# Altium schematic sheet 03.-Main Processor.SchDoc
size A4
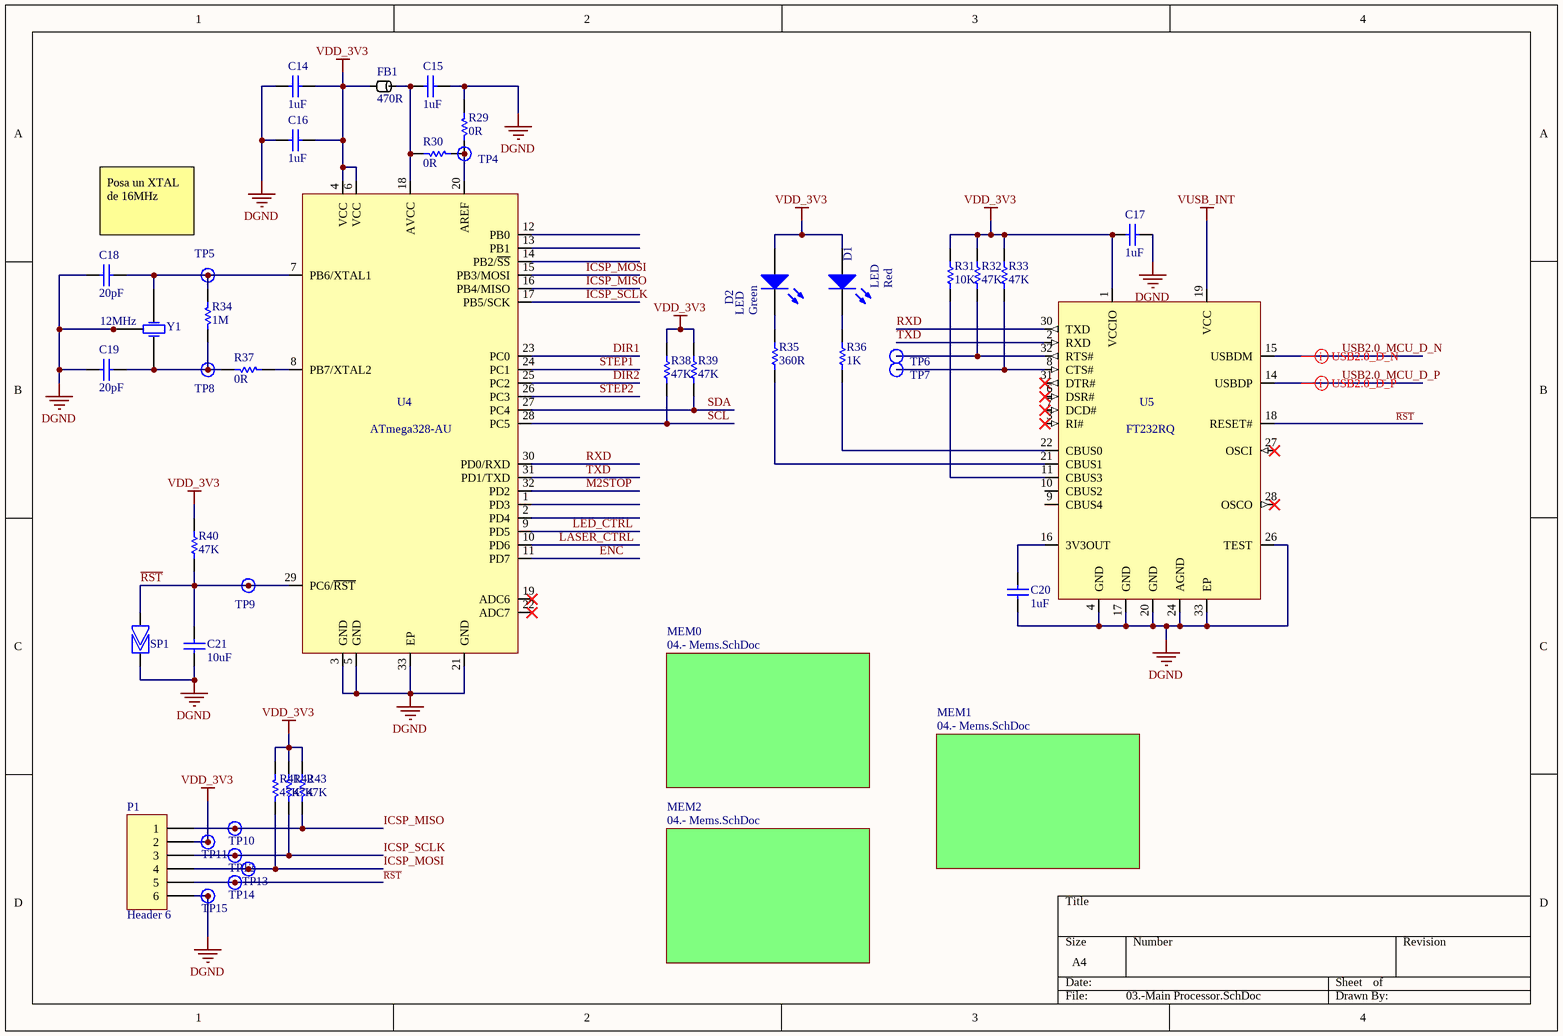
[diagram p0: 03.-Main Processor.SchDoc]

## Parts
C14  1uF  [CAPC1005N]
C15  1uF  [CAPC1005N]
C16  1uF  [CAPC1005N]
C17  1uF  [CAPC1005N]
C18  20pF  [CAPC1608N]
C19  20pF  [CAPC1608N]
C20  1uF  [CAPC1005N]
C21  10uF  [CAPC1608N]
D1  LED  color1: Red  [LED_1206]
D2  LED  color1: Green  [LED_1206]
FB1  470R  [INDC1608M]
P1  Header 6  [HDR1X6]
R29  0R  [RESC1005M]
R30  0R  [RESC1005M]
R31  10K  [RESC1608M]
R32  47K  [RESC1005M]
R33  47K  [RESC1005M]
R34  1M  [RESC1608M]
R35  360R  [RESC1608M]
R36  1K  [RESC1608M]
R37  0R  [RESC1005M]
R38  47K  [RESC1005M]
R39  47K  [RESC1005M]
R40  47K  [RESC1005M]
R41  47K  [RESC1005M]
R42  47K  [RESC1005M]
R43  47K  [RESC1005M]
SP1  SOLDERPAD_2  [SOLDERPAD_2]  (value not drawn)
TP4  TESTPOINT  [TestPoint]  (value not drawn)
TP5  TESTPOINT  [TestPoint]  (value not drawn)
TP6  TESTPOINT  [TestPoint]  (value not drawn)
TP7  TESTPOINT  [TestPoint]  (value not drawn)
TP8  TESTPOINT  [TestPoint]  (value not drawn)
TP9  TESTPOINT  [TestPoint]  (value not drawn)
TP10  TESTPOINT  [TestPoint]  (value not drawn)
TP11  TESTPOINT  [TestPoint]  (value not drawn)
TP12  TESTPOINT  [TestPoint]  (value not drawn)
TP13  TESTPOINT  [TestPoint]  (value not drawn)
TP14  TESTPOINT  [TestPoint]  (value not drawn)
TP15  TESTPOINT  [TestPoint]  (value not drawn)
U4  ATmega328-AU  [TQFP80P900X900-32L]
U5  FT232RQ  [QFN50P500X500-32VAN]
Y1  value 12MHz  [Oscillator 3,2 x 2,5 4pin]  (hidden comment: 403C35D12M00000)

## Sub-sheets
MEM0 = 04.- Mems.SchDoc: no entries
MEM1 = 04.- Mems.SchDoc: no entries
MEM2 = 04.- Mems.SchDoc: no entries

## Nets
DGND: C14.1 C15.2 C16.2 C17.2 C18.1 C19.1 C20.1 C21.1 P1.6 R29.1 SP1.1 TP15.1 U4.3(GND) U4.5(GND) U4.21(GND) U4.33(EP) U5.4(GND) U5.17(GND) U5.20(GND) U5.24(AGND) U5.26(TEST) U5.33(EP) Y1.2(IO1-1) Y1.4(IO1-1)
VDD_3V3: C14.2 C16.1 C17.1 D1.1(A) D2.1(A) FB1.2 P1.2 R31.2 R32.2 R33.2 R38.2 R39.2 R40.2 R41.2 R42.2 R43.2 TP11.1 U4.4(VCC) U4.6(VCC) U5.1(VCCIO)
VUSB_INT: U5.19(VCC)
DIR1: U4.23(PC0)
DIR2: U4.25(PC2)
ENC: U4.11(PD7)
ICSP_MISO: P1.1 R43.1 TP10.1 U4.16(PB4/MISO)
ICSP_MOSI: P1.4 R41.1 TP13.1 U4.15(PB3/MOSI)
ICSP_SCLK: P1.3 R42.1 TP12.1 U4.17(PB5/SCK)
LASER_CTRL: U4.10(PD6)
LED_CTRL: U4.9(PD5)
M2STOP: U4.32(PD2)
~{RST}: C21.2 P1.5 R40.1 SP1.2 TP9.1 TP14.1 U4.29(PC6/~{RST}) U5.18(RESET#)
RXD: U4.30(PD0/RXD) U5.30(TXD)
SCL: R38.1 U4.28(PC5)
SDA: R39.1 U4.27(PC4)
STEP1: U4.24(PC1)
STEP2: U4.26(PC3)
TXD: U4.31(PD1/TXD) U5.2(RXD)
USB2.0_MCU_D_N: U5.15(USBDM)
USB2.0_MCU_D_P: U5.14(USBDP)
NetC15_1: C15.1 FB1.1 R30.2 U4.18(AVCC)
NetC18_2: C18.2 R34.2 TP5.1 U4.7(PB6/XTAL1) Y1.1(IO1-1)
NetC19_2: C19.2 R34.1 R37.2 TP8.1 Y1.3(IO1-1)
NetC20_2: C20.2 U5.16(3V3OUT)
NetD1_2: D1.2(K) R36.2
NetD2_2: D2.2(K) R35.2
NetR29_2: R29.2 R30.1 TP4.1 U4.20(AREF)
NetR31_1: R31.1 U5.11(CBUS3)
NetR32_1: R32.1 TP6.1 U5.32(RTS#)
NetR33_1: R33.1 TP7.1 U5.8(CTS#)
NetR35_1: R35.1 U5.21(CBUS1)
NetR36_1: R36.1 U5.22(CBUS0)
NetR37_1: R37.1 U4.8(PB7/XTAL2)

Not connected (* = marked no-connect by the designer): U4 1(PD3) 2(PD4) 12(PB0) 13(PB1) 14(PB2/~{SS}) 19(ADC6)* 22(ADC7)*; U5 3(RI#)* 6(DSR#)* 7(DCD#)* 9(CBUS4) 10(CBUS2) 27(OSCI)* 28(OSCO)* 31(DTR#)*

## Layout directives
differential pair: USB2.0_MCU_D_N, USB2.0_MCU_D_P

## Notes on the sheet
- Posa un XTAL de 16MHz

## Library data of the parts
C14-C17 C20 = ISR01020111: COND. CER.1uF X5R 16V 0402; Published: 8-Jun-2000; LatestRevisionDate: 17-Jul-2002; LatestRevisionNote: Re-released for DXP Platform.; PackageReference: RAD-0.3; Publisher: Altium Limited; PackageDescription: Radial Cap, Thru-Hole; 2 Leads; 0.3 in Pin Spacing; Value: 1uF; Part Number: ISR01020111; Part Type: NON POL; Code: ISR01020111; Dielectric: X5R; Voltage: 16V; Library path: SIMBOLS_PASSIUS.SCHLIB; Footprint path: Chip_Capacitor_N.PcbLib; DatasheetDocument: http://www.avx.com/docs/Catalogs/cx7r.pdf
C18 C19 = ISR01020103: COND. SMD 20P COG 50V 0603; Published: 8-Jun-2000; LatestRevisionDate: 17-Jul-2002; LatestRevisionNote: Re-released for DXP Platform.; PackageReference: RAD-0.3; Publisher: Altium Limited; PackageDescription: Radial Cap, Thru-Hole; 2 Leads; 0.3 in Pin Spacing; Value: 20pF; Part Number: ISR01020103; Part Type: NON POL; Code: ISR01020103; Dielectric: COG; Voltage: 50V; Library path: SIMBOLS_PASSIUS.SCHLIB; Footprint path: Chip_Capacitor_N.PcbLib
C21 = ISR01020094: COND. SMD 10uF X5R 6V3 0603; Published: 8-Jun-2000; LatestRevisionDate: 17-Jul-2002; LatestRevisionNote: Re-released for DXP Platform.; PackageReference: RAD-0.3; Publisher: Altium Limited; PackageDescription: Radial Cap, Thru-Hole; 2 Leads; 0.3 in Pin Spacing; Value: 10uF; Part Number: ISR01020094; Part Type: NON POL; Code: ISR01020094; Dielectric: X5R; Voltage: 6V3; Library path: SIMBOLS_PASSIUS.SCHLIB; Footprint path: Chip_Capacitor_N.PcbLib
D1 = LXZ1-PD01: LUXEON Z Vermell 1A 3.15V; Code: ISR04060001; Value: 0; Magatzem: KS; Quantitat: 10; LatestRevisionDate: 05-oct-2007  -  Semtech; Part Number: LXZ1-PD01; Part Type: LED; Library path: SIMBOLS_SEMICONDUCTORS.SCHLIB; Footprint path: FootprintsPersonals.PcbLib
D2 = LXZ1-PM01: LUXEON Z Verd 1A 3.15V; Code: ISR04060002; Value: 0; Magatzem: KS; Quantitat: 10; LatestRevisionDate: 05-oct-2007  -  Semtech; Part Number: LXZ1-PM01; Part Type: LED; Library path: SIMBOLS_SEMICONDUCTORS.SCHLIB; Footprint path: FootprintsPersonals.PcbLib
FB1 = BLM18PG471SN1p: Ferrita SMD 470R@100MHz 25% 1A 0603; Code: ISR01040007; SRF: 100MHz; DCR: 0.2R; Impedance: *; Frequency: *; Current: *; Part Number: BLM18PG471SN1p; Part Type: FERRITES; IDC: 1A; Value: 470R; Tolerance: 25%; Library path: SIMBOLS_PASSIUS.SCHLIB; Footprint path: Chip_Inductor_M.PcbLib; DatasheetDocument: http://search.murata.co.jp/Ceramy/image/img/PDF/ENG/L0110S0100BLM18P.pdf
P1 = Header 6: Header, 6-Pin; LatestRevisionDate: 17-Jul-2002; LatestRevisionNote: Re-released for DXP Platform.; Publisher: Altium Limited
R29 R30 R37 = ISR01010776: Resistencia SMD 0402 1% 0R; Published: 8-Jun-2000; LatestRevisionDate: 17-Jul-2002; LatestRevisionNote: Re-released for DXP Platform.; PackageReference: AXIAL-0.5; Publisher: Altium Limited; PackageDescription: Axial Device, Thru-Hole; 2 Leads; 0.5 in Pin Spacing; Value: 0R; Part Number: ISR01010776; Part Type: SMD/RESISTORS; Code: ISR01010776; Tolerance: 1%; Library path: SIMBOLS_PASSIUS.SCHLIB; Footprint path: Chip_Resistor_M.PcbLib
R31 = ISR01010121: Resistencia SMD 0603 5% 10K; Published: 8-Jun-2000; LatestRevisionDate: 17-Jul-2002; LatestRevisionNote: Re-released for DXP Platform.; PackageReference: AXIAL-0.5; Publisher: Altium Limited; PackageDescription: Axial Device, Thru-Hole; 2 Leads; 0.5 in Pin Spacing; Value: 10K; Part Number: ISR01010121; Part Type: SMD/RESISTORS; Code: ISR01010121; Tolerance: 5%; Library path: SIMBOLS_PASSIUS.SCHLIB; Footprint path: Chip_Resistor_M.PcbLib
R32 R33 R38-R43 = ISR01010913: Resistencia SMD 0402 1% 47K; Published: 8-Jun-2000; LatestRevisionDate: 17-Jul-2002; LatestRevisionNote: Re-released for DXP Platform.; PackageReference: AXIAL-0.5; Publisher: Altium Limited; PackageDescription: Axial Device, Thru-Hole; 2 Leads; 0.5 in Pin Spacing; Tolerance: 1%; Value: 47K; Part Number: ISR01010913; Part Type: SMD/RESISTORS; Code: ISR01010913; Library path: SIMBOLS_PASSIUS.SCHLIB; Footprint path: Chip_Resistor_M.PcbLib
R34 = ISR01010169: Resistencia SMD 0603 5% 1M; Published: 8-Jun-2000; LatestRevisionDate: 17-Jul-2002; LatestRevisionNote: Re-released for DXP Platform.; PackageReference: AXIAL-0.5; Publisher: Altium Limited; PackageDescription: Axial Device, Thru-Hole; 2 Leads; 0.5 in Pin Spacing; Tolerance: 5%; Value: 1M; Part Number: ISR01010169; Part Type: SMD/RESISTORS; Code: ISR01010169; Library path: SIMBOLS_PASSIUS.SCHLIB; Footprint path: Chip_Resistor_M.PcbLib
R35 = ISR01010086: Resistencia SMD 0603 5% 360R; Published: 8-Jun-2000; LatestRevisionDate: 17-Jul-2002; LatestRevisionNote: Re-released for DXP Platform.; PackageReference: AXIAL-0.5; Publisher: Altium Limited; PackageDescription: Axial Device, Thru-Hole; 2 Leads; 0.5 in Pin Spacing; Value: 360R; Part Number: ISR01010086; Part Type: SMD/RESISTORS; Code: ISR01010086; Tolerance: 5%; Library path: SIMBOLS_PASSIUS.SCHLIB; Footprint path: Chip_Resistor_M.PcbLib
R36 = ISR01010097: Resistencia SMD 0603 5% 1K; Published: 8-Jun-2000; LatestRevisionDate: 17-Jul-2002; LatestRevisionNote: Re-released for DXP Platform.; PackageReference: AXIAL-0.5; Publisher: Altium Limited; PackageDescription: Axial Device, Thru-Hole; 2 Leads; 0.5 in Pin Spacing; Value: 1K; Part Number: ISR01010097; Part Type: SMD/RESISTORS; Code: ISR01010097; Tolerance: 5%; Library path: SIMBOLS_PASSIUS.SCHLIB; Footprint path: Chip_Resistor_M.PcbLib
SP1 = SOLDERPAD_2: Code: ISR04030005; Part Number: SOLDERPAD_2; Part Type: PCB; Value: SOLDERPAD_2; Library path: SIMBOLS_CONNECTORS.SCHLIB; Footprint path: FootprintsPersonals.PcbLib
TP4-TP15 = STP0003: TEST POINT INLINE; Code: ISR04030001; Value: TP; Part Number: STP0003; Part Type: TESTPOINTS; Library path: SIMBOLS_CONNECTORS.SCHLIB; Footprint path: FootprintsPersonals.PcbLib
U4 = ATmega328-AU: ATMEL 8-BIT MICROCONTROLLER WITH 32KBYTES IN-SYSTEM PROGRAMMABLE FLASH  TQFP32; Code: ISR02010248; Bus width: 8; Voltage: 1V8-5V5; Voltage max: 5V5; FLASH: 32K; SRAM: 2K; Part Number: ATmega328-AU; Part Type: MCU; Value: ATmega328-AU; Library path: SIMBOLS_CPU_MCU.SCHLIB; Footprint path: QFP_Thin_Sq_80P_Side_L.PcbLib
U5 = FT232RQ: USB-TO-UART, SMD, 32LQFP; Code: ISR02050019; Part Number: FT232RQ; Part Type: USB-RS232; Value: FT232RQ; Library path: FTDI Communication UART.SchLib; Footprint path: QFN_Sq_50P_Side_N.PcbLib
Y1 = 403C35D12M00000: CRISTALL SMD 12MHz 30ppm 3V3 18pF; Code: ISR01090005; PartNo: 403C35D12M00000; Part Number: 403C35D12M00000; Part Type: XTAL; Voltage: 3V3; Tolerancia: 30ppm; Cload: 18pF; Library path: SIMBOLS_FREQ.SCHLIB; Footprint path: FootprintsPersonals.PcbLib